# EAGLE design inamp (EAGLE 7.2.0)
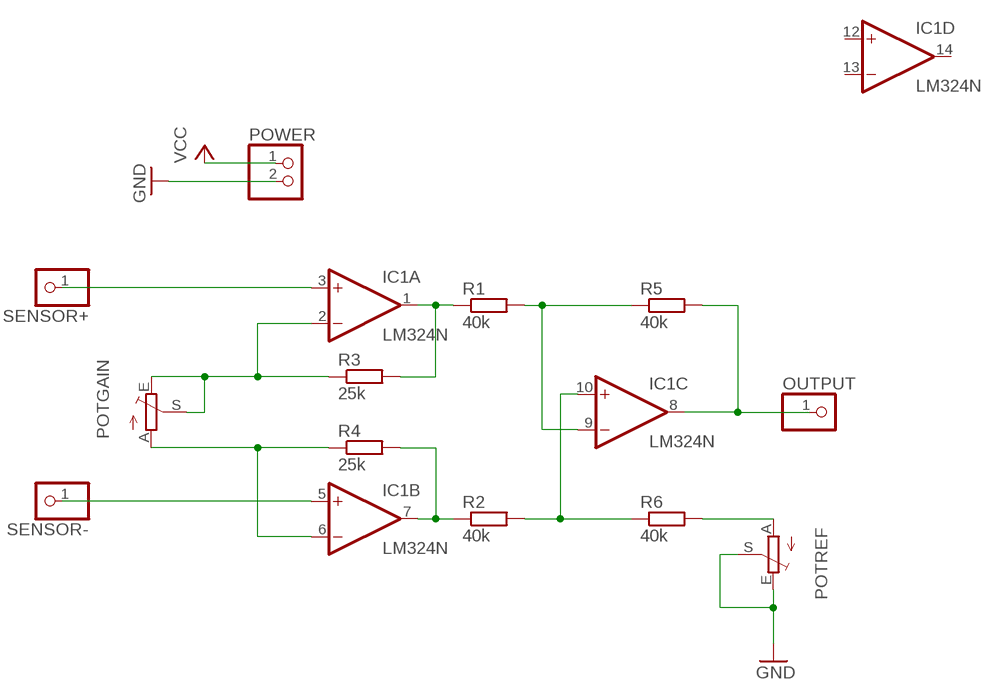
[diagram p0: schematic, sheet 1]

## Parts
IC1  LM324N  [DIL14]
OUTPUT  PINHD-1X1  [1X01]
POTGAIN  TRIM_EU-CA6V  [CA6V]
POTREF  TRIM_EU-CA6V  [CA6V]
POWER  PINHD-1X2  [1X02]
R1  40k  R-EU_0204/7  [0204/7]
R2  40k  R-EU_0204/7  [0204/7]
R3  25k  R-EU_0204/7  [0204/7]
R4  25k  R-EU_0204/7  [0204/7]
R5  40k  R-EU_0204/7  [0204/7]
R6  40k  R-EU_0204/7  [0204/7]
SENSOR+  PINHD-1X1  [1X01]
SENSOR-  PINHD-1X1  [1X01]

## Nets
GND: POTREF.E POTREF.S POWER.2
N$1: IC1.1(A:OUT) R1.1 R3.2
N$2: IC1.7(B:OUT) R2.1 R4.2
N$3: IC1.9(C:-IN) R1.2 R5.1
N$4: IC1.10(C:+IN) R2.2 R6.1
N$5: IC1.2(A:-IN) POTGAIN.E POTGAIN.S R3.1
N$6: IC1.6(B:-IN) POTGAIN.A R4.1
N$7: POTREF.A R6.2
N$10: IC1.8(C:OUT) OUTPUT.1 R5.2
N$11: IC1.5(B:+IN) SENSOR-.1
SENSOR+: IC1.3(A:+IN) SENSOR+.1
VCC: POWER.1
Unconnected: IC1.12(D:+IN) IC1.13(D:-IN) IC1.14(D:OUT)

## Power pins joined to a net without a drawn wire
GND: IC1.11(P:V-)
VCC: IC1.4(P:V+)

## Library data of the parts
IC1 = linear:LM324: OP AMP
OUTPUT SENSOR+ SENSOR- = pinhead:PINHD-1X1: PIN HEADER
POTGAIN POTREF = pot:TRIM_EU-: POTENTIOMETER
POWER = pinhead:PINHD-1X2: PIN HEADER
R1-R6 = resistor:R-EU_: RESISTOR, European symbol

## Board
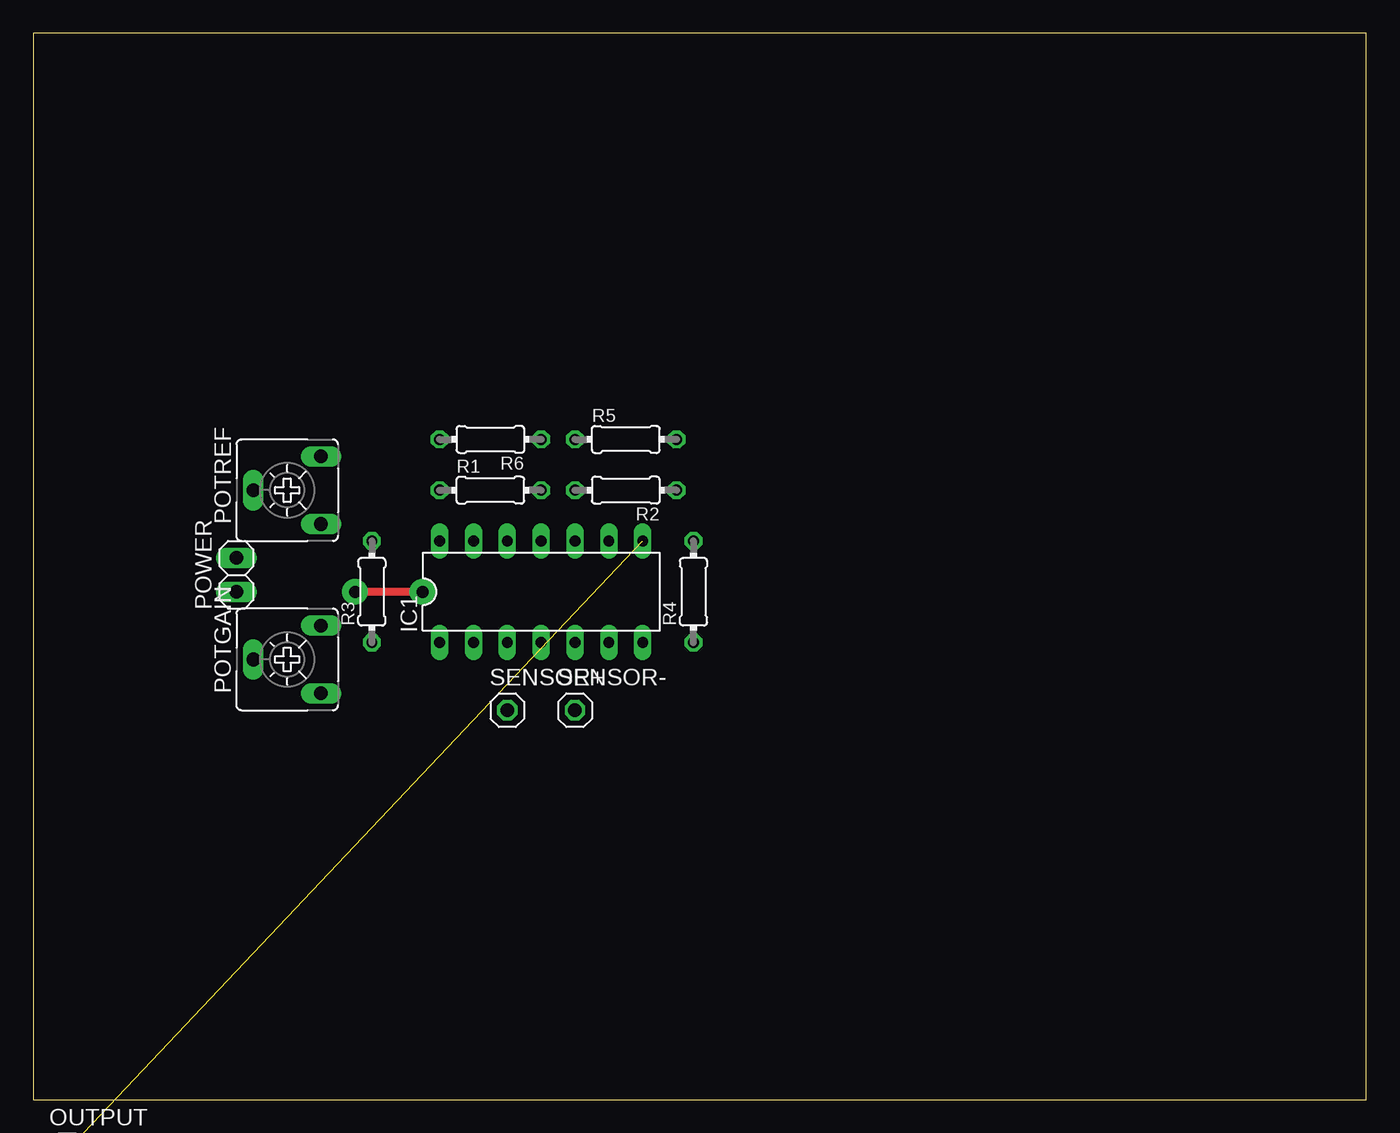
[diagram p1: board, top side]
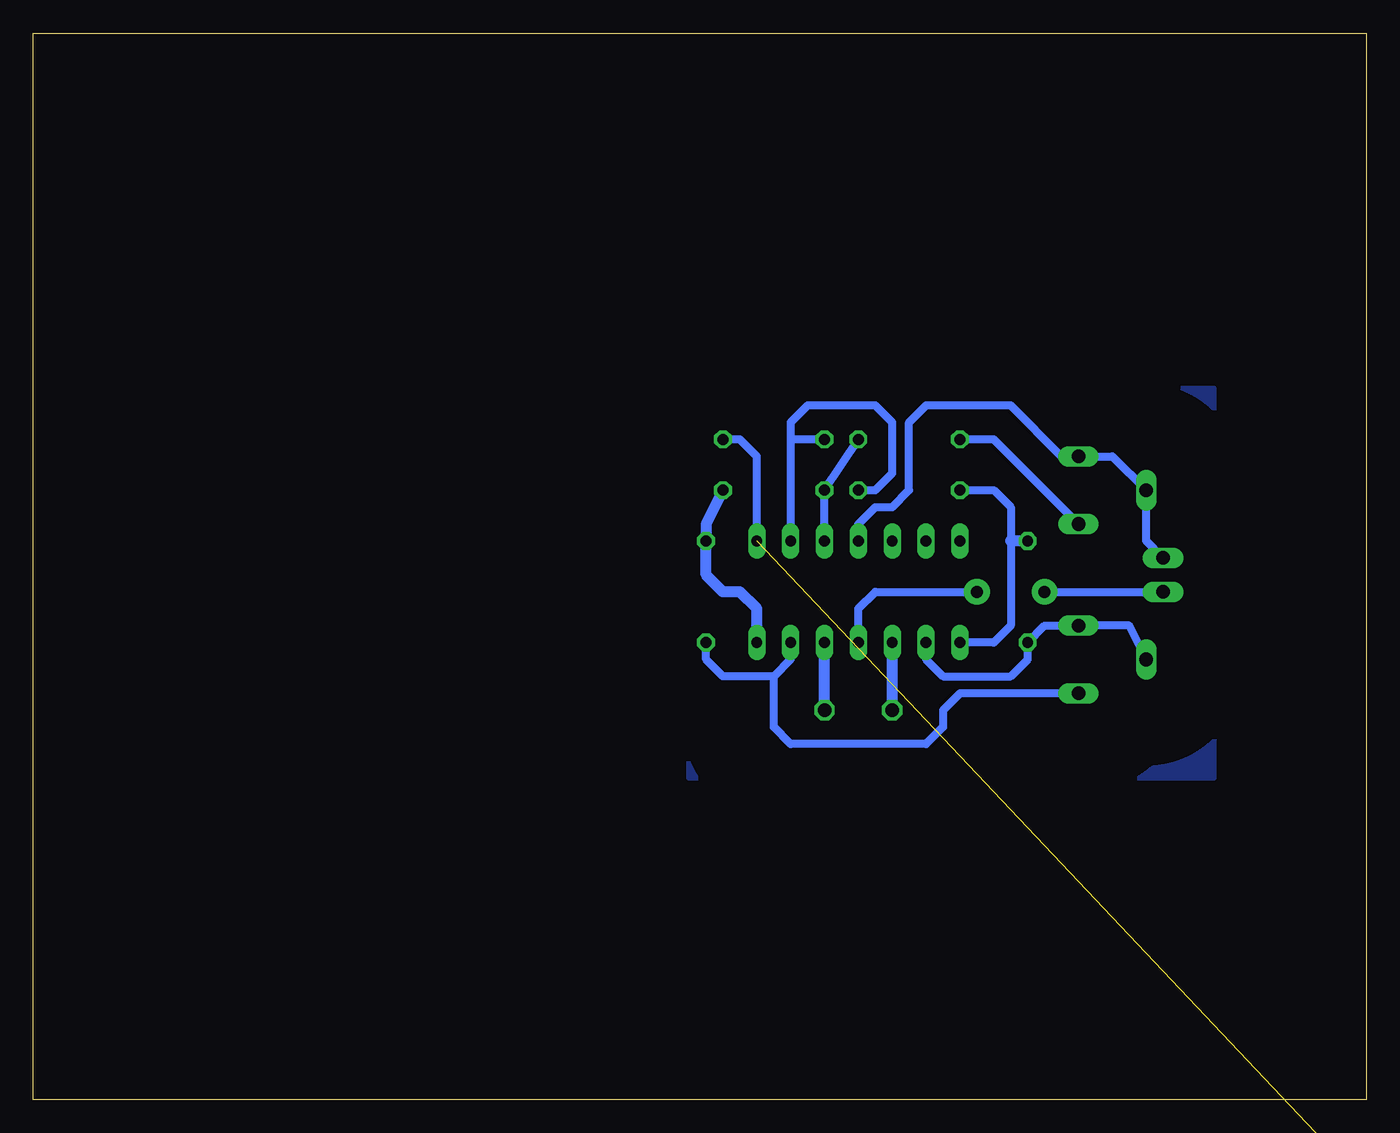
[diagram p2: board, bottom side, seen from below]

Size 100 x 80 mm. Coordinates in mm from the lower left corner, seen from the top.
Outline: 0,0 100,0 100,80 0,80 0,0
Copper layers (1*16): Top 0.035mm / dielectric 1.5mm / Bottom 0.035mm
Design rules "default": minimum track width 10mil, minimum drill 24mil, track to track 8mil, track to pad 8mil, pad to pad 8mil, via to via 8mil, smd to smd 8mil, copper to edge 40mil, drill to drill 8mil, minimum pad ring 10mil, minimum via ring 8mil, stop-mask expansion 4mil, vias tented up to drill 0mil, thermal gap 10mil

### Footprints (pad centres in the part's own frame; a part is rotated, then mirrored left to right if it is on the bottom)
DIL14 = drill 0.813 long: 1 -7.62,-3.81; 2 -5.08,-3.81; 3 -2.54,-3.81; 4 0,-3.81; 5 2.54,-3.81; 6 5.08,-3.81; 7 7.62,-3.81; 8 7.62,3.81; 9 5.08,3.81; 10 2.54,3.81; 11 0,3.81; 12 -2.54,3.81; 13 -5.08,3.81; 14 -7.62,3.81
1X01 = drill 1.016 octagon: 1 0,0
CA6V = drill 1.016 long: A -2.54,-2.54; E 2.54,-2.54; S 0,2.54
1X02 = drill 1.016 long: 1 -1.27,0; 2 1.27,0
0204/7 = drill 0.813 octagon: 1 -3.81,0; 2 3.81,0

### Placement (x,y rotation side)
IC1  38.1,38.1 0 top
OUTPUT  2.54,-3.81 0 top  (outside the outline)
POTGAIN  19.05,33.02 90 top
POTREF  19.05,45.72 90 top
POWER  15.24,39.37 90 top
R1  34.29,45.72 0 top
R2  44.45,45.72 180 top
R3  25.4,38.1 90 top
R4  49.53,38.1 90 top
R5  44.45,49.53 0 top
R6  34.29,49.53 180 top
SENSOR+  35.56,29.21 0 top
SENSOR-  40.64,29.21 0 top

### Tracks (layer width: path | path; a pad name or v marks a point on that pad's centre or on a via)
GND
  Bottom 0.61: POWER.2 16.51,41.91 POTREF.S 19.05,48.26 POTREF.E 22.86,48.26 26.67,52.07 33.02,52.07 34.29,50.8 34.29,45.72 35.56,44.45 36.83,44.45 38.1,43.18 IC1.11
  pour Bottom (isolate 6.452): 12.7,49.53 12.7,27.94 15.24,25.4 53.34,25.4 55.88,27.94 55.88,49.53 53.34,52.07 15.24,52.07
N$1
  Bottom 0.61: R1.1 27.94,45.72 26.67,44.45 26.67,41.91 26.67,35.56 27.94,34.29 IC1.1
  Bottom 0.813: R3.2 26.67,41.91
N$2
  Bottom 0.813: IC1.7 45.72,36.83 46.99,38.1 48.26,38.1 49.53,39.37 R4.2 49.53,43.18 R2.1
N$3
  Bottom 0.61: 43.18,49.53 43.18,50.8 41.91,52.07 36.83,52.07 35.56,50.8 35.56,46.99 36.83,45.72 R1.2 | 43.18,49.53 IC1.9 | R5.1 43.18,49.53
N$4
  Bottom 0.61: IC1.10 R2.2 R6.1
N$5
  Bottom 0.61: POTGAIN.S 17.78,35.56 POTGAIN.E 24.13,35.56 R3.1 25.4,33.02 26.67,31.75 31.75,31.75 33.02,33.02 IC1.2
N$6
  Bottom 0.61: IC1.6 43.18,33.02 44.45,31.75 | 44.45,31.75 48.26,31.75 49.53,33.02 R4.1 | POTGAIN.A 30.48,30.48 31.75,29.21 31.75,27.94 33.02,26.67 43.18,26.67 44.45,27.94 44.45,31.75
N$7
  Bottom 0.61: POTREF.A 27.94,49.53 R6.2
N$8
  pour Bottom (isolate 6.452): 11.43,53.34 50.8,53.34 50.8,24.13 11.43,24.13
N$10  (1 unrouted)
  Bottom 0.61: IC1.8 45.72,48.26 46.99,49.53 R5.2
N$11
  Bottom 0.813: SENSOR-.1 IC1.5
SENSOR+
  Bottom 0.813: SENSOR+.1 IC1.3
VCC  (via drill 0.9 pad 1.93)
  Top 0.61: v29.21,38.1 v24.13,38.1
  Bottom 0.61: IC1.4 38.1,36.83 36.83,38.1 v29.21,38.1 | v24.13,38.1 POWER.1